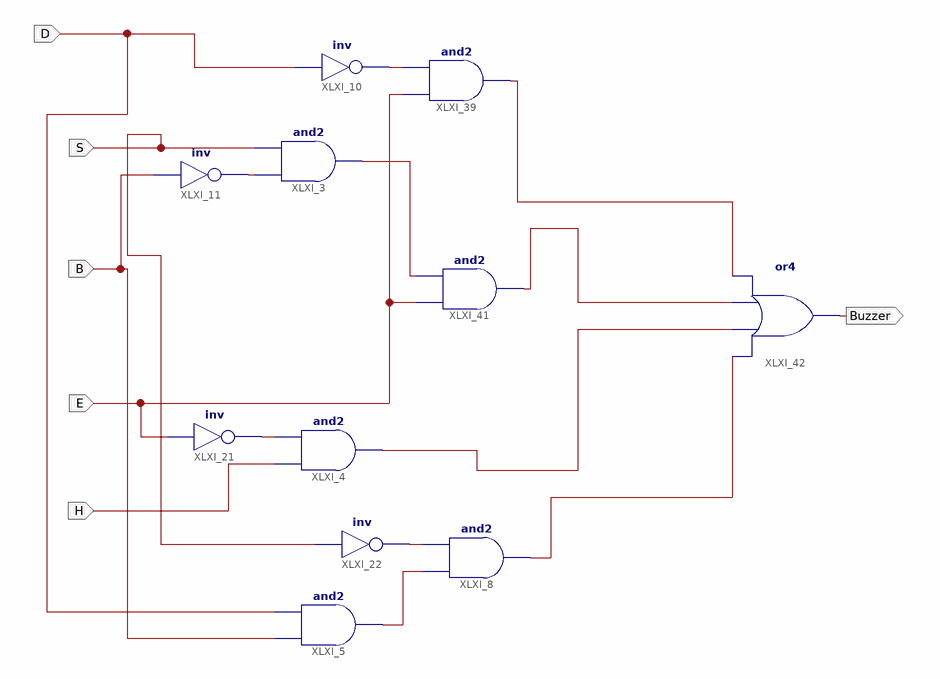
[diagram p0: schematic sheet 1]
// Xilinx ISE schematic main.sch (spartan6) as structural Verilog: 11 symbols, 6 ports
module main (
  input  S,
  input  D,
  input  B,
  input  H,
  input  E,
  output Buzzer
);

  wire XLXN_7, XLXN_8, XLXN_22, XLXN_27, XLXN_29, XLXN_30, XLXN_32, XLXN_68, XLXN_75, XLXN_76;

  not XLXI_11 (XLXN_8, B);
  and XLXI_3 (XLXN_68, XLXN_8, S);
  not XLXI_10 (XLXN_7, D);
  and XLXI_4 (XLXN_76, H, XLXN_27);
  and XLXI_5 (XLXN_30, B, D);
  and XLXI_8 (XLXN_32, XLXN_30, XLXN_29);
  not XLXI_21 (XLXN_27, E);
  not XLXI_22 (XLXN_29, S);
  and XLXI_39 (XLXN_22, E, XLXN_7);
  and XLXI_41 (XLXN_75, E, XLXN_68);
  or XLXI_42 (Buzzer, XLXN_32, XLXN_76, XLXN_75, XLXN_22);
endmodule
